# Altium schematic sheet BlueCar.SchDoc
size A4 portrait; CompanyName: BlueCar
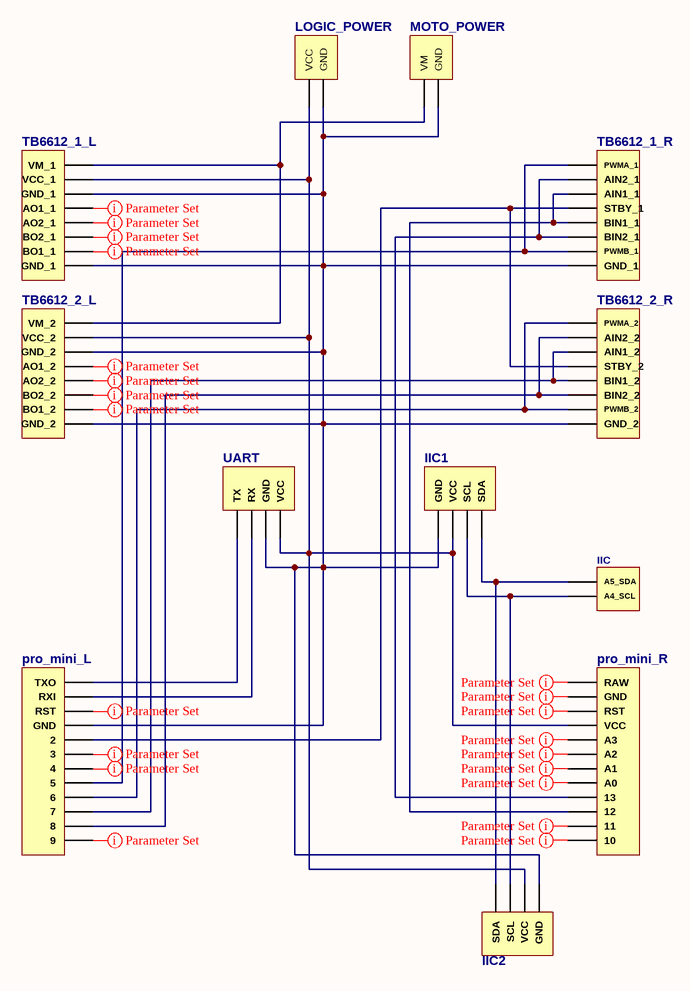
[diagram p0: BlueCar.SchDoc]

## Parts
IIC  Header 2  [HDR1X2]  (value not drawn)
IIC1  Header 4  [HDR1X4]  (value not drawn)
IIC2  Header 4  [HDR1X4]  (value not drawn)
LOGIC_POWER  Header 2  [HDR1X2]  (value not drawn)
MOTO_POWER  Header 2  [HDR1X2]  (value not drawn)
pro_mini_L  Header 12  [HDR1X12]  (value not drawn)
pro_mini_R  Header 12  [HDR1X12]  (value not drawn)
TB6612_1_L  Header 8  [HDR1X8]  (value not drawn)
TB6612_1_R  Header 8  [HDR1X8]  (value not drawn)
TB6612_2_L  Header 8  [HDR1X8]  (value not drawn)
TB6612_2_R  Header 8  [HDR1X8]  (value not drawn)
UART  Header 4  [HDR1X4]  (value not drawn)

## Nets
NetIIC1_1: IIC1.1(GND) IIC2.1(GND) LOGIC_POWER.2(GND) MOTO_POWER.2(GND) pro_mini_L.9(GND) TB6612_1_L.3(GND_1) TB6612_1_L.8(GND_1) TB6612_1_R.8(GND_1) TB6612_2_L.1(GND_2) TB6612_2_L.6(GND_2) TB6612_2_R.8(GND_2) UART.3(GND)
NetIIC1_2: IIC1.2(VCC) IIC2.2(VCC) LOGIC_POWER.1(VCC) pro_mini_R.4(VCC) TB6612_1_L.2(VCC_1) TB6612_2_L.7(VCC_2) UART.4(VCC)
NetIIC_1: IIC.1(A5_SDA) IIC1.4(SDA) IIC2.4(SDA)
NetIIC_2: IIC.2(A4_SCL) IIC1.3(SCL) IIC2.3(SCL)
NetMOTO_POWER_1: MOTO_POWER.1(VM) TB6612_1_L.1(VM_1) TB6612_2_L.8(VM_2)
Netpro_mini_L_2: pro_mini_L.2(8) TB6612_2_R.2(AIN2_2) TB6612_2_R.6(BIN2_2)
Netpro_mini_L_3: pro_mini_L.3(7) TB6612_2_R.3(AIN1_2) TB6612_2_R.5(BIN1_2)
Netpro_mini_L_4: pro_mini_L.4(6) TB6612_2_R.1(PWMA_2) TB6612_2_R.7(PWMB_2)
Netpro_mini_L_5: pro_mini_L.5 TB6612_1_R.1(PWMA_1) TB6612_1_R.7(PWMB_1)
Netpro_mini_L_8: pro_mini_L.8(2) TB6612_1_R.4(STBY_1) TB6612_2_R.4(STBY_2)
Netpro_mini_L_11: pro_mini_L.11(RXI) UART.2(RX)
Netpro_mini_L_12: pro_mini_L.12(TXO) UART.1(TX)
Netpro_mini_R_9: pro_mini_R.9(13) TB6612_1_R.2(AIN2_1) TB6612_1_R.6(BIN2_1)
Netpro_mini_R_10: pro_mini_R.10(12) TB6612_1_R.3(AIN1_1) TB6612_1_R.5(BIN1_1)

Not connected (* = marked no-connect by the designer): pro_mini_L 1(9) 6(4) 7(3) 10(RST); pro_mini_R 1(RAW) 2(GND) 3(RST) 5(A3) 6(A2) 7(A1) 8(A0) 11 12(10); TB6612_1_L 4(AO1_1) 5(AO2_1) 6(BO2_1) 7(BO1_1); TB6612_2_L 2(BO1_2) 3(BO2_2) 4(AO2_2) 5(AO1_2)

## Library data of the parts
IIC LOGIC_POWER MOTO_POWER = Header 2: Header, 2-Pin; LatestRevisionDate: 17-Jul-2002; LatestRevisionNote: Re-released for DXP Platform.; Publisher: Altium Limited
IIC1 IIC2 UART = Header 4: Header, 4-Pin; LatestRevisionDate: 17-Jul-2002; LatestRevisionNote: Re-released for DXP Platform.; Publisher: Altium Limited
pro_mini_L pro_mini_R = Header 12: Header, 12-Pin; LatestRevisionDate: 17-Jul-2002; LatestRevisionNote: Re-released for DXP Platform.; Publisher: Altium Limited
TB6612_1_L TB6612_1_R TB6612_2_L TB6612_2_R = Header 8: Header, 8-Pin; LatestRevisionDate: 17-Jul-2002; LatestRevisionNote: Re-released for DXP Platform.; Publisher: Altium Limited